# Altium schematic sheet SCH_DTACK Card 16 DIP_2023-08-05_Altium.schdoc
size 265 x 116 mm
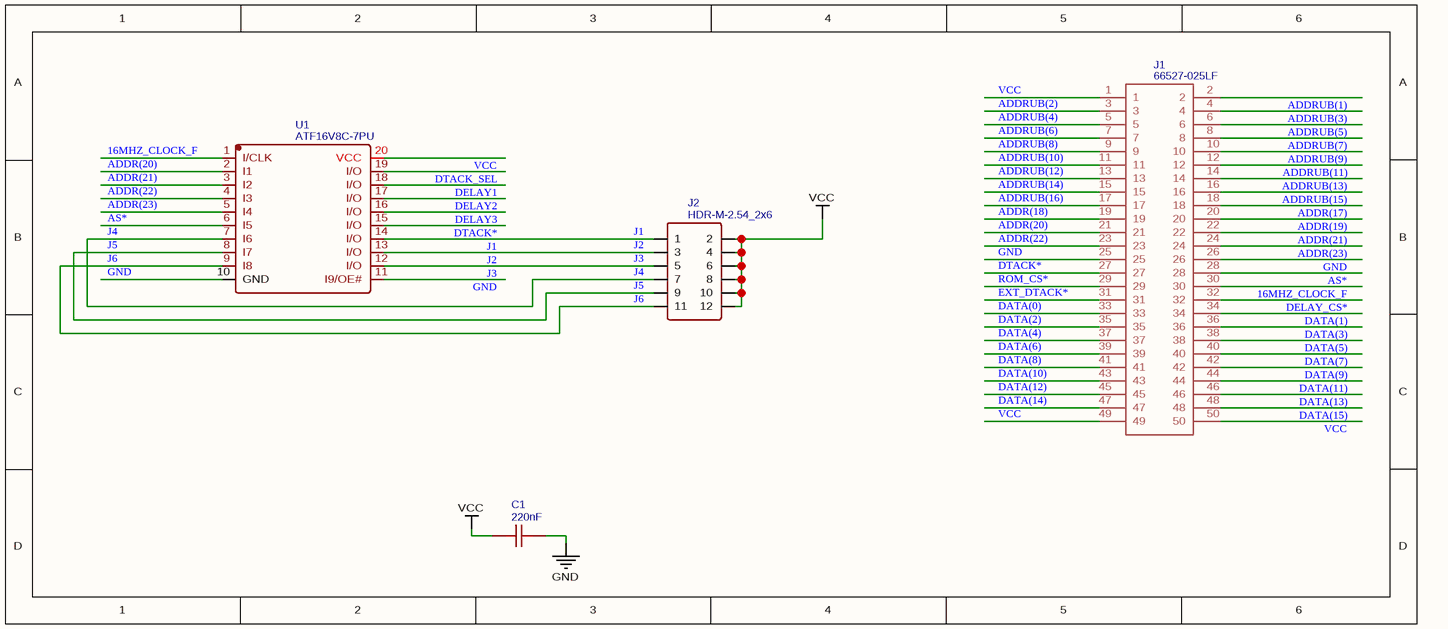
[diagram p0: SCH_DTACK Card 16 DIP_2023-08-05_Altium.schdoc]

## Parts
C1  220nF  [CAP-TH_L4.0-W2.5-P2.50-D0.5]
J1  66527-025LF  [66527025LF]
J2  HDR-M-2.54_2x6  [HDR-M-2.54_2X6]
U1  ATF16V8C-7PU  [DIP-20_L25.4-W7.1-P2.54-LS8.5-BL]

## Nets
GND: C1.2 J1.25 J1.26 U1.10(GND) U1.11(I9/OE#)
VCC: C1.1 J1.1 J1.49 J1.50 J2.2 J2.4 J2.6 J2.8 J2.10 J2.12 U1.20(VCC)
16MHZ_CLOCK_F: J1.30 U1.1(I/CLK)
ADDR(17): J1.18
ADDR(18): J1.19
ADDR(19): J1.20
ADDR(20): J1.21 U1.2(I1)
ADDR(21): J1.22 U1.3(I2)
ADDR(22): J1.23 U1.4(I3)
ADDR(23): J1.24 U1.5(I4)
ADDRUB(1): J1.2
ADDRUB(2): J1.3
ADDRUB(3): J1.4
ADDRUB(4): J1.5
ADDRUB(5): J1.6
ADDRUB(6): J1.7
ADDRUB(7): J1.8
ADDRUB(8): J1.9
ADDRUB(9): J1.10
ADDRUB(10): J1.11
ADDRUB(11): J1.12
ADDRUB(12): J1.13
ADDRUB(13): J1.14
ADDRUB(14): J1.15
ADDRUB(15): J1.16
ADDRUB(16): J1.17
AS*: J1.28 U1.6(I5)
DATA(0): J1.33
DATA(1): J1.34
DATA(2): J1.35
DATA(3): J1.36
DATA(4): J1.37
DATA(5): J1.38
DATA(6): J1.39
DATA(7): J1.40
DATA(8): J1.41
DATA(9): J1.42
DATA(10): J1.43
DATA(11): J1.44
DATA(12): J1.45
DATA(13): J1.46
DATA(14): J1.47
DATA(15): J1.48
DELAY1: U1.18(I/O)
DELAY2: U1.17(I/O)
DELAY3: U1.16(I/O)
DELAY_CS*: J1.32
DTACK*: J1.27 U1.15(I/O)
DTACK_SEL: U1.19(I/O)
EXT_DTACK*: J1.31
J1: J2.1 U1.14(I/O)
J2: J2.3 U1.13(I/O)
J3: J2.5 U1.12(I/O)
J4: J2.7 U1.7(I6)
J5: J2.9 U1.8(I7)
J6: J2.11 U1.9(I8)
ROM_CS*: J1.29

## Library data of the parts
C1 = 220nF: Manufacturer: TDK; Contributor: LCSC; nameAlias: Value; Supplier: LCSC; Supplier Part: C1623186; JLCPCB Part Class: Extended Part; spicePre: C; spiceSymbolName: FG18X7R1H224KRT06
J1 = 66527-025LF: Contributor: rezafouladian; spicePre: J; spiceSymbolName: 66527-025LF
J2 = HDR-M-2.54_2x6: Contributor: LCEDA_Lib; Supplier Part: C124388; Supplier: LCSC; spicePre: J; spiceSymbolName: HDR-M-2.54_2x6
U1 = ATF16V8C-7PU: Manufacturer: MICROCHIP(美国微芯); Contributor: LCSC; Supplier: LCSC; Supplier Part: C613484; JLCPCB Part Class: Extended Part; spicePre: U; spiceSymbolName: ATF16V8C-7PU